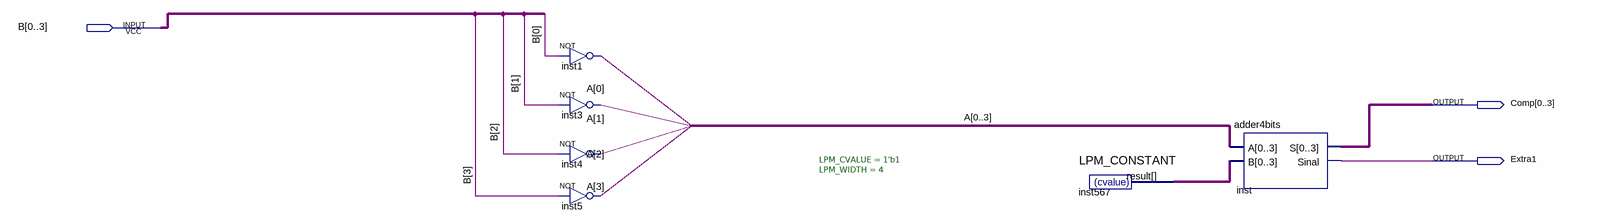
[diagram p0: schematic sheet]
// Quartus schematic Compa24bits.bdf as structural Verilog: 6 symbols, 3 pins
module Compa24bits (
  input  [0:3] B,
  output [0:3] Comp,
  output Extra1
);

  wire [3:0] A, inst567_result;

  not inst1 (A[0], B[0]);
  not inst3 (A[1], B[1]);
  not inst4 (A[2], B[2]);
  not inst5 (A[3], B[3]);
  LPM_CONSTANT #(.LPM_CVALUE(1'b1), .LPM_WIDTH(4)) inst567 (.result(inst567_result));
  adder4bits inst (.A({A[0], A[1], A[2], A[3]}), .B(inst567_result), .S(Comp), .Sinal(Extra1));
endmodule
